# EAGLE design 74LS198 (EAGLE 7.7.0)
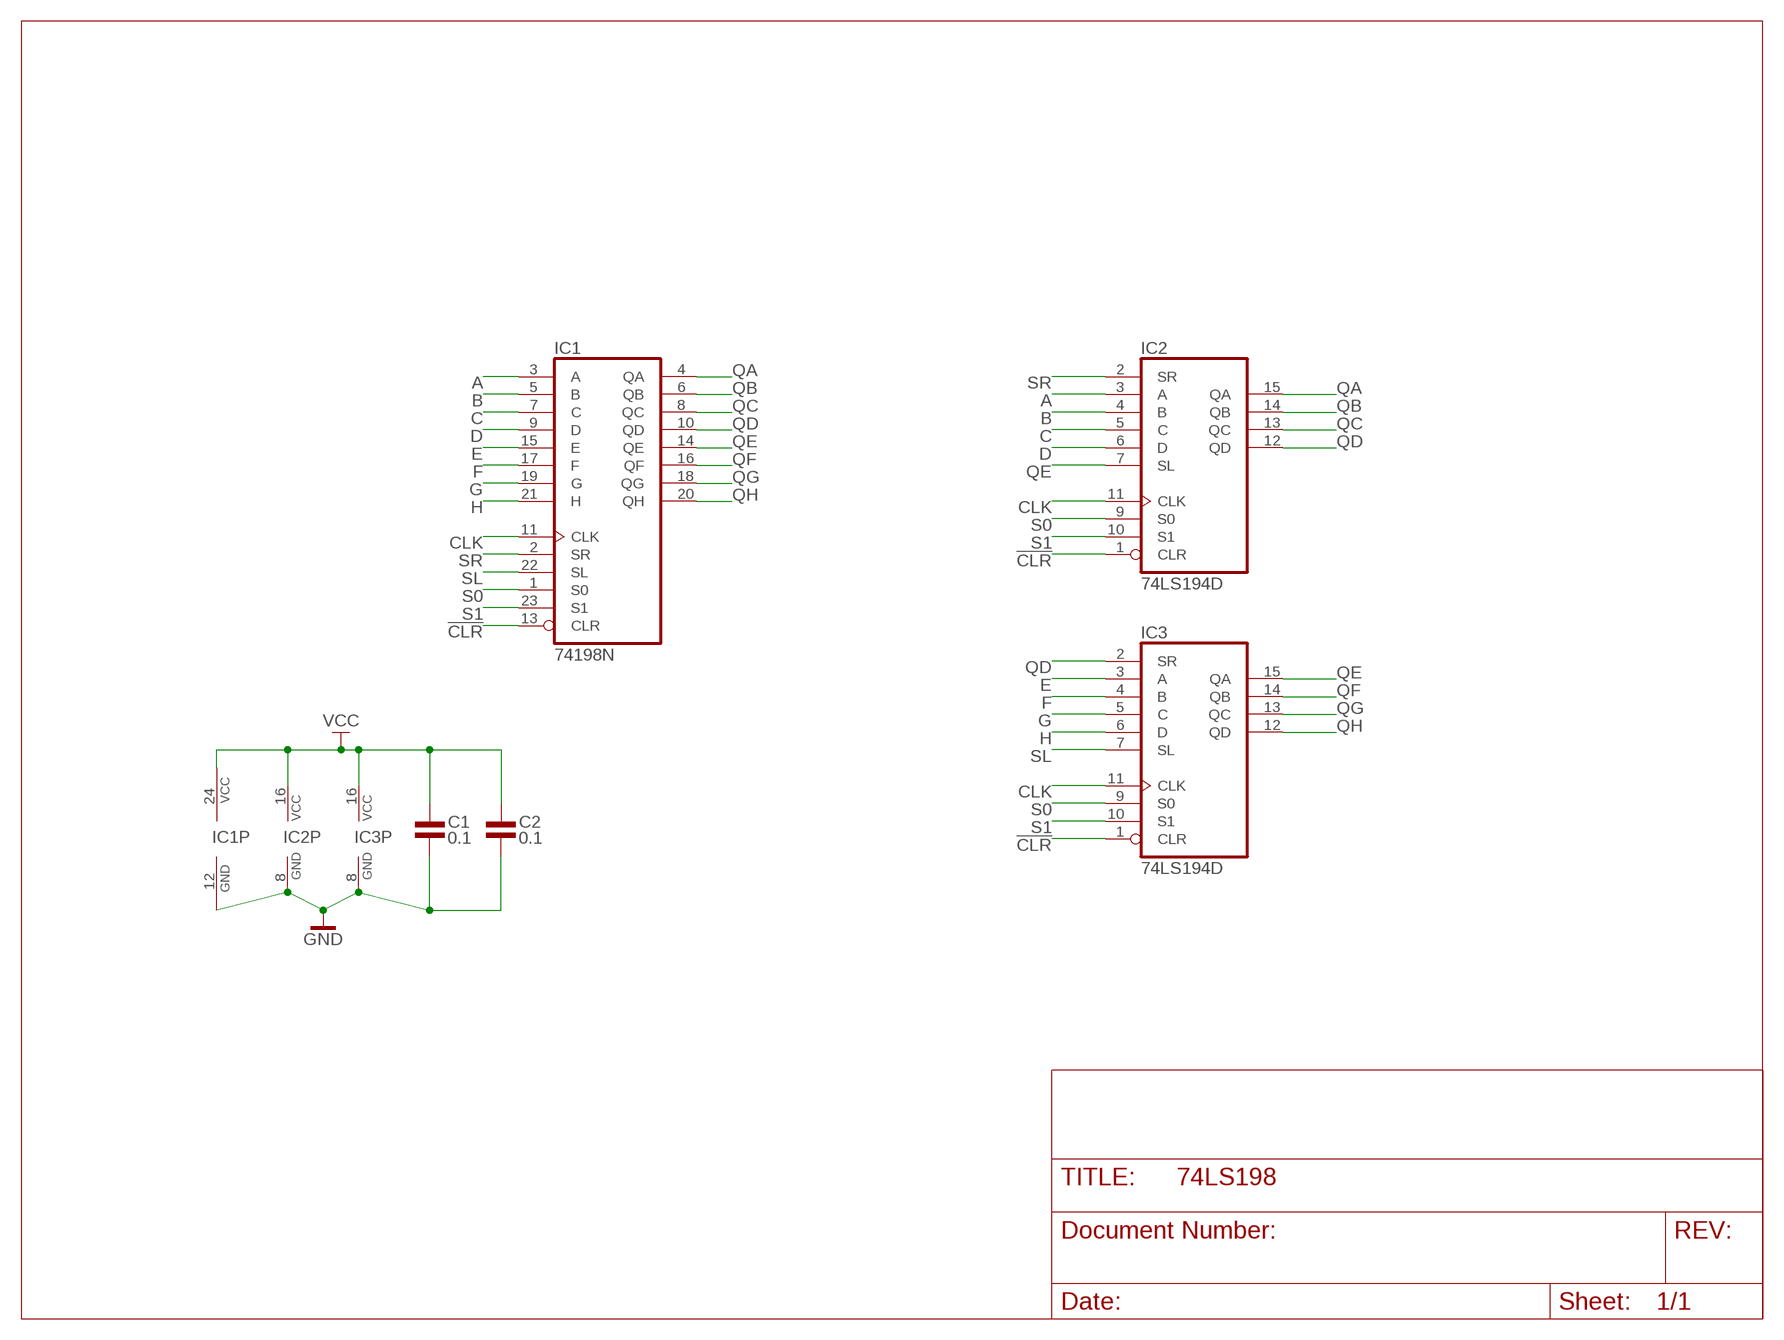
[diagram p0: schematic, sheet 1]

## Parts
C1  0.1  CAPACITOR_SMD0805  [0805]
C2  0.1  CAPACITOR_SMD0805  [0805]
IC1  74198N  [DIP24W]
IC2  74LS194D  [SO16]
IC3  74LS194D  [SO16]

## Nets
!CLR: IC1.13(CLR) IC2.1(CLR) IC3.1(CLR)
A: IC1.3(A) IC2.3(A)
B: IC1.5(B) IC2.4(B)
C: IC1.7(C) IC2.5(C)
CLK: IC1.11(CLK) IC2.11(CLK) IC3.11(CLK)
D: IC1.9(D) IC2.6(D)
E: IC1.15(E) IC3.3(A)
F: IC1.17(F) IC3.4(B)
G: IC1.19(G) IC3.5(C)
GND: C1.1 C2.1 IC1.12(GND) IC2.8(GND) IC3.8(GND)
H: IC1.21(H) IC3.6(D)
QA: IC1.4(QA) IC2.15(QA)
QB: IC1.6(QB) IC2.14(QB)
QC: IC1.8(QC) IC2.13(QC)
QD: IC1.10(QD) IC2.12(QD) IC3.2(SR)
QE: IC1.14(QE) IC2.7(SL) IC3.15(QA)
QF: IC1.16(QF) IC3.14(QB)
QG: IC1.18(QG) IC3.13(QC)
QH: IC1.20(QH) IC3.12(QD)
S0: IC1.1(S0) IC2.9(S0) IC3.9(S0)
S1: IC1.23(S1) IC2.10(S1) IC3.10(S1)
SL: IC1.22(SL) IC3.7(SL)
SR: IC1.2(SR) IC2.2(SR)
VCC: C1.2 C2.2 IC1.24(VCC) IC2.16(VCC) IC3.16(VCC)

## Library data of the parts
C1 C2 = 1_eagle_lib:CAPACITOR_SMD
IC1 = 1_eagle_lib:74*198: 8-bit SHIFT REGISTER
IC2 IC3 = 1_eagle_lib:74*194: 4-bit bidirectional SHIFT REGISTER

## Board
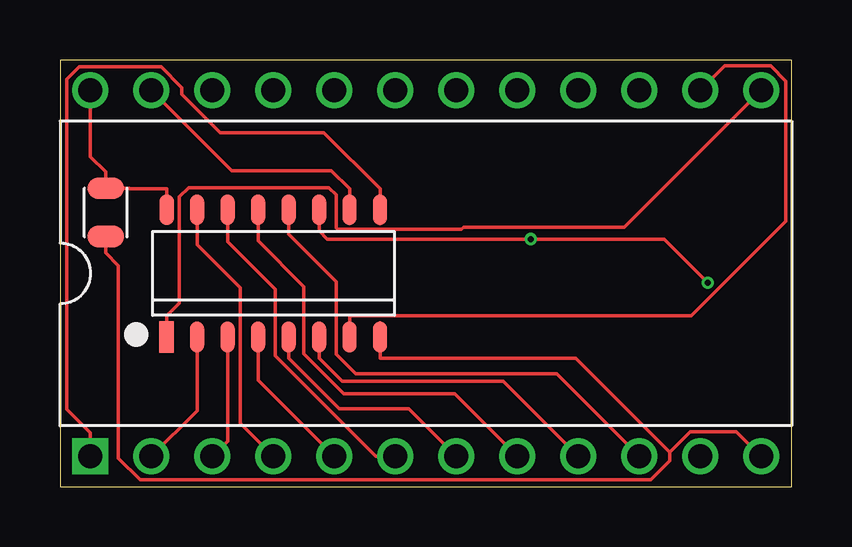
[diagram p1: board, top side]
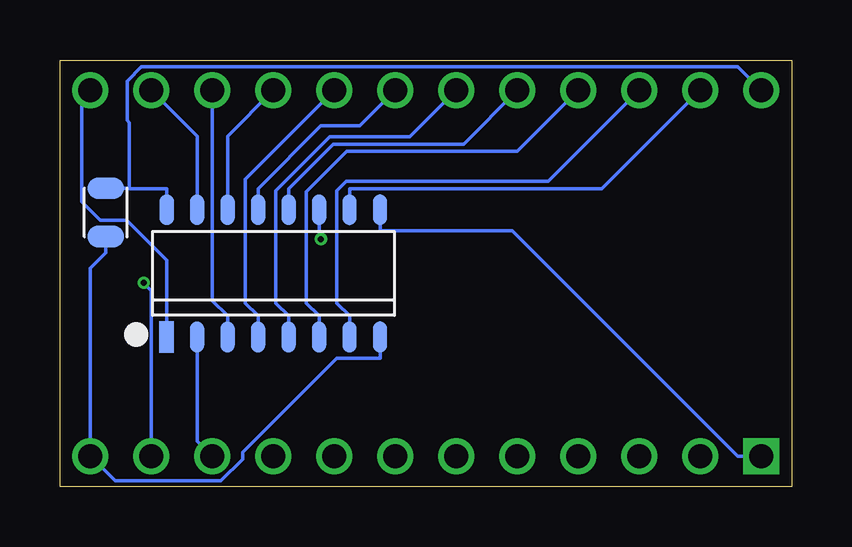
[diagram p2: board, bottom side, seen from below]

Size 30.48 x 17.78 mm. Coordinates in mm from the lower left corner, seen from the top.
Outline: 0,0 30.48,0 30.48,17.78 0,17.78 0,0
Copper layers (1*16): Top 0.035559375mm / dielectric 1.6mm / Bottom 0.035559375mm
Design rules "oshpark-2layer-tented": minimum track width 6mil, minimum drill 10mil, track to track 6mil, track to pad 6mil, pad to pad 6mil, via to via 6mil, smd to smd 6mil, copper to edge 15mil, drill to drill 6mil, minimum pad ring 5mil, minimum via ring 5mil, stop-mask expansion 2.5mil, vias tented up to drill 20mil, thermal gap 10mil

### Footprints (pad centres in the part's own frame; a part is rotated, then mirrored left to right if it is on the bottom)
0805 = smd 0.914 x 1.524: 1 -1.003,0; 2 1.003,0
DIP24W = drill 1 square: 1 -13.97,-7.62 | drill 1: 2 -11.43,-7.62; 3 -8.89,-7.62; 4 -6.35,-7.62; 5 -3.81,-7.62; 6 -1.27,-7.62; 7 1.27,-7.62; 8 3.81,-7.62; 9 6.35,-7.62; 10 8.89,-7.62; 11 11.43,-7.62; 12 13.97,-7.62; 13 13.97,7.62; 14 11.43,7.62; 15 8.89,7.62; 16 6.35,7.62; 17 3.81,7.62; 18 1.27,7.62; 19 -1.27,7.62; 20 -3.81,7.62; 21 -6.35,7.62; 22 -8.89,7.62; 23 -11.43,7.62; 24 -13.97,7.62
SO16 = smd 0.6 x 1.3: 1 -4.445,-2.65; 2 -3.175,-2.65; 3 -1.905,-2.65; 4 -0.635,-2.65; 5 0.635,-2.65; 6 1.905,-2.65; 7 3.175,-2.65; 8 4.445,-2.65; 9 4.445,2.65; 10 3.175,2.65; 11 1.905,2.65; 12 0.635,2.65; 13 -0.635,2.65; 14 -1.905,2.65; 15 -3.175,2.65; 16 -4.445,2.65

### Placement (x,y rotation side)
C1  28.58,11.43 90 bottom
C2  1.9,11.43 90 top
IC1  15.24,8.89 0 top
IC2  8.89,8.89 0 top
IC3  21.59,8.89 0 bottom

### Tracks (layer width: path | path; a pad name or v marks a point on that pad's centre or on a via)
!CLR
  Top 0.152: IC2.1 4.45,7.12 4.97,7.65 4.97,12.08 5.36,12.46 11.2,12.46 11.51,12.16 11.51,10.79 11.58,10.72 16.72,10.72 16.82,10.82 23.52,10.82 IC1.13
  Bottom 0.152: IC3.1 26.04,9.44 27.71,11.11 28.8,11.11 29.57,11.88 29.57,16.15 IC1.13
A
  Top 0.152: IC2.3 6.98,1.91 IC1.3
B
  Top 0.152: IC2.4 8.25,4.45 IC1.5
C
  Top 0.152: IC2.5 9.53,5.36 11.63,3.26 14.52,3.26 IC1.7
CLK  (via drill 0.25 pad 0.51)
  Top 0.152: IC2.11 10.79,10.66 11.14,10.32 v19.61,10.32 25.17,10.32 v26.99,8.5
  Bottom 0.152: IC1.11 26.67,8.18 v26.99,8.5 | IC3.11 19.69,10.39 v19.61,10.32
D
  Top 0.152: IC2.6 10.79,5.36 11.76,4.4 18.46,4.4 IC1.9
E
  Bottom 0.152: IC3.3 23.5,7.12 24.13,7.75 IC1.15
F
  Bottom 0.152: IC3.4 22.23,7.12 22.75,7.65 22.75,12.81 IC1.17
G
  Bottom 0.152: IC3.5 20.95,7.12 21.48,7.65 21.48,12.34 19.24,14.58 15.9,14.58 IC1.19
GND
  Top 0.152: 25.4,1.45 25.4,1.09 24.61,0.29 3.34,0.29 2.43,1.2 2.43,9.21 1.9,9.74 C2.1 | IC1.12 28.18,2.3 26.25,2.3 25.4,1.45 | 25.4,1.45 21.48,5.36 13.34,5.36 IC2.8
  Bottom 0.152: IC3.8 17.14,5.36 18.94,5.36 22.86,1.44 22.86,1.15 23.77,0.24 28.18,0.24 IC1.12 29.21,9.11 28.58,9.74 C1.1
H
  Bottom 0.152: IC1.21 11.43,13.97 18.53,13.97 20.21,12.29 20.21,7.65 19.69,7.12 IC3.6
QA
  Top 0.152: IC2.15 5.71,10.09 7.51,8.29 7.51,2.65 IC1.4
QB
  Top 0.152: IC1.6 13.16,1.27 8.97,5.46 8.97,8.23 6.98,10.21 IC2.14
QC
  Top 0.152: IC2.13 8.25,10.24 10.16,8.34 10.16,5.54 11.83,3.87 16.45,3.87 IC1.8
QD
  Top 0.152: IC2.12 9.53,10.51 11.51,8.53 11.51,5.52 12.32,4.71 20.69,4.71 IC1.10
  Bottom 0.152: IC3.2 24.77,1.91 IC1.10
QE
  Top 0.152: IC2.7 12.07,7.12 26.3,7.12 30.24,11.06 30.24,16.91 29.61,17.54 27.7,17.54 IC1.14
  Bottom 0.152: IC3.15 24.77,14.61 IC1.14
QF
  Bottom 0.152: IC3.14 23.5,14.61 IC1.16
QG
  Bottom 0.152: IC3.13 22.23,12.42 19.61,15.04 17.98,15.04 IC1.18
QH
  Bottom 0.152: IC1.20 13.67,14.28 19.1,14.28 20.95,12.42 IC3.12
S0
  Top 0.152: IC1.1 1.27,2.25 0.29,3.23 0.29,16.98 0.8,17.49 4.22,17.49 5.08,16.63 5.08,16.34 6.67,14.75 11,14.75 13.34,12.42 IC2.9
  Bottom 0.152: IC1.1 2.25,1.27 11.64,10.66 17.14,10.66 IC3.9
S1
  Top 0.152: IC2.10 12.07,12.42 11.31,13.17 7.15,13.17 IC1.23
  Bottom 0.152: IC1.23 7.9,12.42 18.41,12.42 IC3.10
SL
  Bottom 0.152: IC3.7 18.41,7.12 18.94,7.65 18.94,12.34 18.55,12.72 10.14,12.72 IC1.22
SR
  Top 0.152: IC2.2 5.71,3.18 IC1.2
VCC
  Top 0.152: IC1.24 1.27,13.75 1.9,13.12 C2.2 2.9,12.43 2.91,12.42 4.45,12.42 IC2.16
  Bottom 0.152: IC1.24 2.25,17.49 27.09,17.49 27.67,16.9 27.67,15.26 27.58,15.18 27.58,12.43 | C1.2 27.58,12.43 | IC3.16 26.04,12.42 27.57,12.42 27.58,12.43